# EAGLE schematic JD-RangeFinder - Scematics v4 (EAGLE 9.7.0)
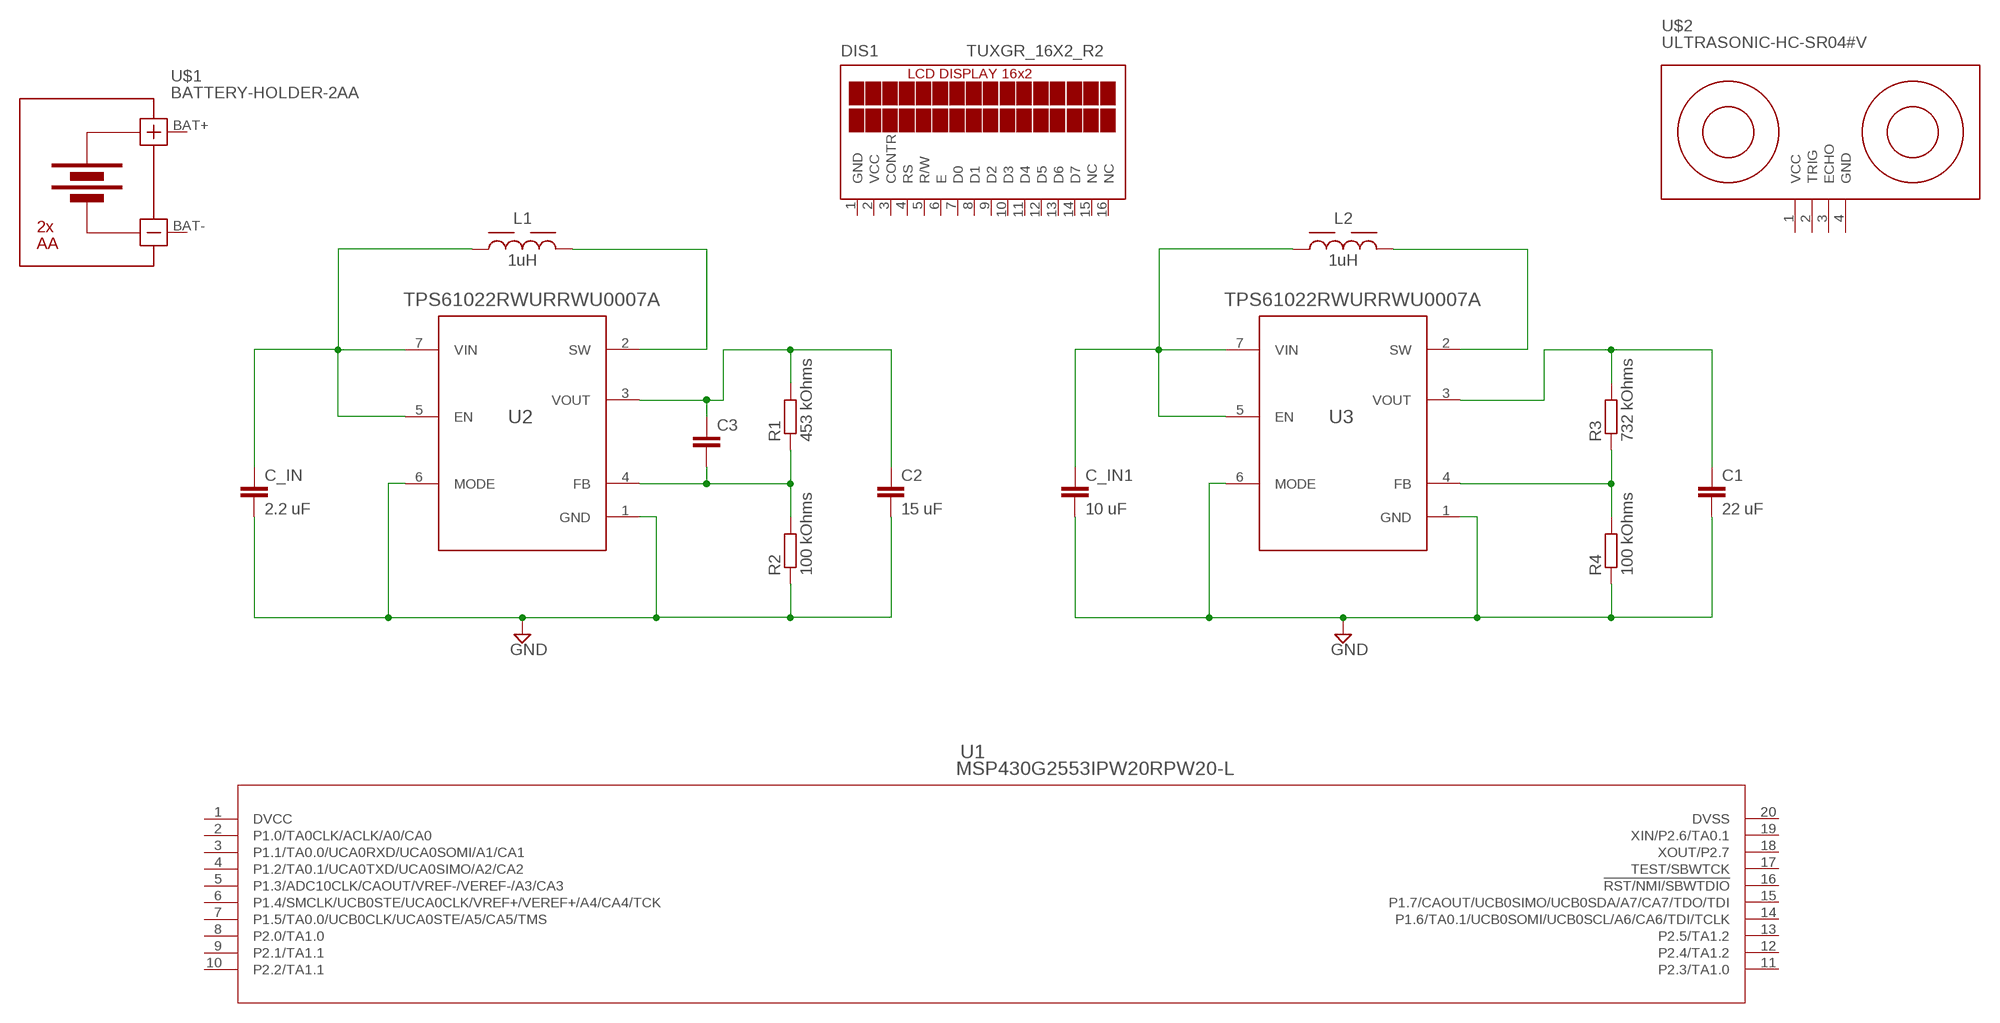
[diagram p0: schematic, sheet 1]

## Parts
C1  22 uF  C-EUC0805  [C0805]
C2  15 uF  C-EUC0805  [C0805]
C3  C-EUC0805  [C0805]
C_IN  2.2 uF  C-EUC0805  [C0805]
C_IN1  10 uF  C-EUC0805  [C0805]
DIS1  TUXGR_16X2_R2  [TUXGR_16X2_R2]
L1  1uH  WE-LQS_4025_74404043010A  [WE-LQS_4025]
L2  1uH  WE-LQS_4025_74404043010A  [WE-LQS_4025]
R1  453 kOhms  R-EU_R0805  [R0805]
R2  100 kOhms  R-EU_R0805  [R0805]
R3  732 kOhms  R-EU_R0805  [R0805]
R4  100 kOhms  R-EU_R0805  [R0805]
U1  MSP430G2553IPW20RPW20-L  [PW20-L]
U2  TPS61022RWURRWU0007A  [RWU0007A]
U3  TPS61022RWURRWU0007A  [RWU0007A]
U$1  BATTERY-HOLDER-2AA  [BATTERY-HOLDER-2AA]
U$2  ULTRASONIC-HC-SR04#V  [ULTRASONIC-HC-SR04#V]

## Nets
GND: C1.2 C2.2 C_IN1.2 C_IN.2 R2.1 R4.1 U2.1(GND) U2.6(MODE) U3.1(GND) U3.6(MODE)
N$1: L1.2 U2.2(SW)
N$2: C_IN.1 L1.1 U2.5(EN) U2.7(VIN)
N$4: C3.2 R1.1 R2.2 U2.4(FB)
N$5: C2.1 C3.1 R1.2 U2.3(VOUT)
N$6: L2.2 U3.2(SW)
N$7: C_IN1.1 L2.1 U3.5(EN) U3.7(VIN)
N$9: R3.1 R4.2 U3.4(FB)
N$10: C1.1 R3.2 U3.3(VOUT)
Unconnected: DIS1.3(CONTR) DIS1.4(RS) DIS1.5(R/W) DIS1.6(E) DIS1.7(D0) DIS1.8(D1) DIS1.9(D2) DIS1.10(D3) DIS1.11(D4) DIS1.12(D5) DIS1.13(D6) DIS1.14(D7) DIS1.15(NC) DIS1.16(NC) U1.2(P1.0/TA0CLK/ACLK/A0/CA0) U1.3(P1.1/TA0.0/UCA0RXD/UCA0SOMI/A1/CA1) U1.4(P1.2/TA0.1/UCA0TXD/UCA0SIMO/A2/CA2) U1.5(P1.3/ADC10CLK/CAOUT/VREF-/VEREF-/A3/CA3) U1.6(P1.4/SMCLK/UCB0STE/UCA0CLK/VREF+/VEREF+/A4/CA4/TCK) U1.7(P1.5/TA0.0/UCB0CLK/UCA0STE/A5/CA5/TMS) U1.8(P2.0/TA1.0) U1.9(P2.1/TA1.1) U1.10(P2.2/TA1.1) U1.11(P2.3/TA1.0) U1.12(P2.4/TA1.2) U1.13(P2.5/TA1.2) U1.14(P1.6/TA0.1/UCB0SOMI/UCB0SCL/A6/CA6/TDI/TCLK) U1.15(P1.7/CAOUT/UCB0SIMO/UCB0SDA/A7/CA7/TDO/TDI) U1.16(!RST/NMI/SBWTDIO) U1.17(TEST/SBWTCK) U1.18(XOUT/P2.7) U1.19(XIN/P2.6/TA0.1) U$2.2(TRIG) U$2.3(ECHO)

## Power pins joined to a net without a drawn wire
BAT+: U$1.BAT+
BAT-: U$1.BAT-
DVCC: U1.1(DVCC)
DVSS: U1.20(DVSS)
GND: DIS1.1(GND) U$2.4(GND)
VCC: DIS1.2(VCC) U$2.1(VCC)

## Library data of the parts
C1-C3 C_IN C_IN1 = rcl:C-EU: CAPACITOR, European symbol; SPICEPREFIX: C
DIS1 = display-lcd:TUXGR_16X2_R2: Tuxgraphics LCD display 16x2 characters reflective, without background light Source: tuxgr_12x2_r2.pdf; OC_FARNELL: unknown; OC_NEWARK: unknown
L1 L2 = Inductor 1uH 17mOhms:WE-LQS_4025: WE-LQS SMD Power Inductor Semi Shielded Characteristics Compact design Power Inductor 1.7 times more current than compared to an unshielded version Robust construction Low RDC Magnetically shielded by use of a magnetic resin Operating temperature: -40°C to +125°C Applications Integrated DC/DC Converters Switching controllers which require high efficiency Portable power (PDA, Smartphones, Digital Cameras, TVs, LCD etc.) Embedded Laptops and PCs Big sizes can be used in shock resisting circuits <https://www.we-online.com/catalog/media/o14807v209%20Family_WE-LQS.jpg> Details see: www.we-online.com/catalog/WE-LQS <www.we-online.com/catalog/WE-LQS/?utm_source=eagle_model&utm_medium=description_link&utm_campaign=eisos_eagle> Updated by Ella Wu 2022-07-21 2022 (C) Wurth Elektronik; DATASHEET-URL: https://www.we-online.com/redexpert/spec/74404043010A?ae; FRES: 167MHz; IR: 4.9A; ISAT: 3.22A; PART-NUMBER: 74404043010A; RDC: 14mOhm
R1-R4 = rcl:R-EU_: RESISTOR, European symbol; SPICEPREFIX: R
U1 = JD-RangeFinder:MSP430G2553IPW20R; COPYRIGHT: Copyright (C) 2024 Ultra Librarian. All rights reserved.; MANUFACTURER_PART_NUMBER: MSP430G2553IPW20R; MFR_NAME: Texas Instruments
U2 U3 = DC-DC Switch:TPS61022RWUR; COPYRIGHT: Copyright (C) 2024 Ultra Librarian. All rights reserved.; MANUFACTURER_PART_NUMBER: TPS61022RWUR; MFR_NAME: Texas Instruments; REFDES: RefDes; TYPE: TYPE
U$1 = DIY-Modules Libraries:BATTERY-HOLDER-2AA: Battery Holder 2 x AA Click here to find device on ebay.com <http://www.ebay.com/sch/battery+plastic+holder+aa+2x1.5v>
U$2 = DIY-Modules Libraries:ULTRASONIC-HC-SR04: Ultrasonic Ranging Module HC-SR04 More details available here: http://randomnerdtutorials.com/complete-guide-for-ultrasonic-sensor-hc-sr04/ Click here to find device on ebay.com <http://www.ebay.com/sch/hc+sr04+ultrasonic>